# EAGLE design DCC sDecoder (EAGLE 9.6.2)
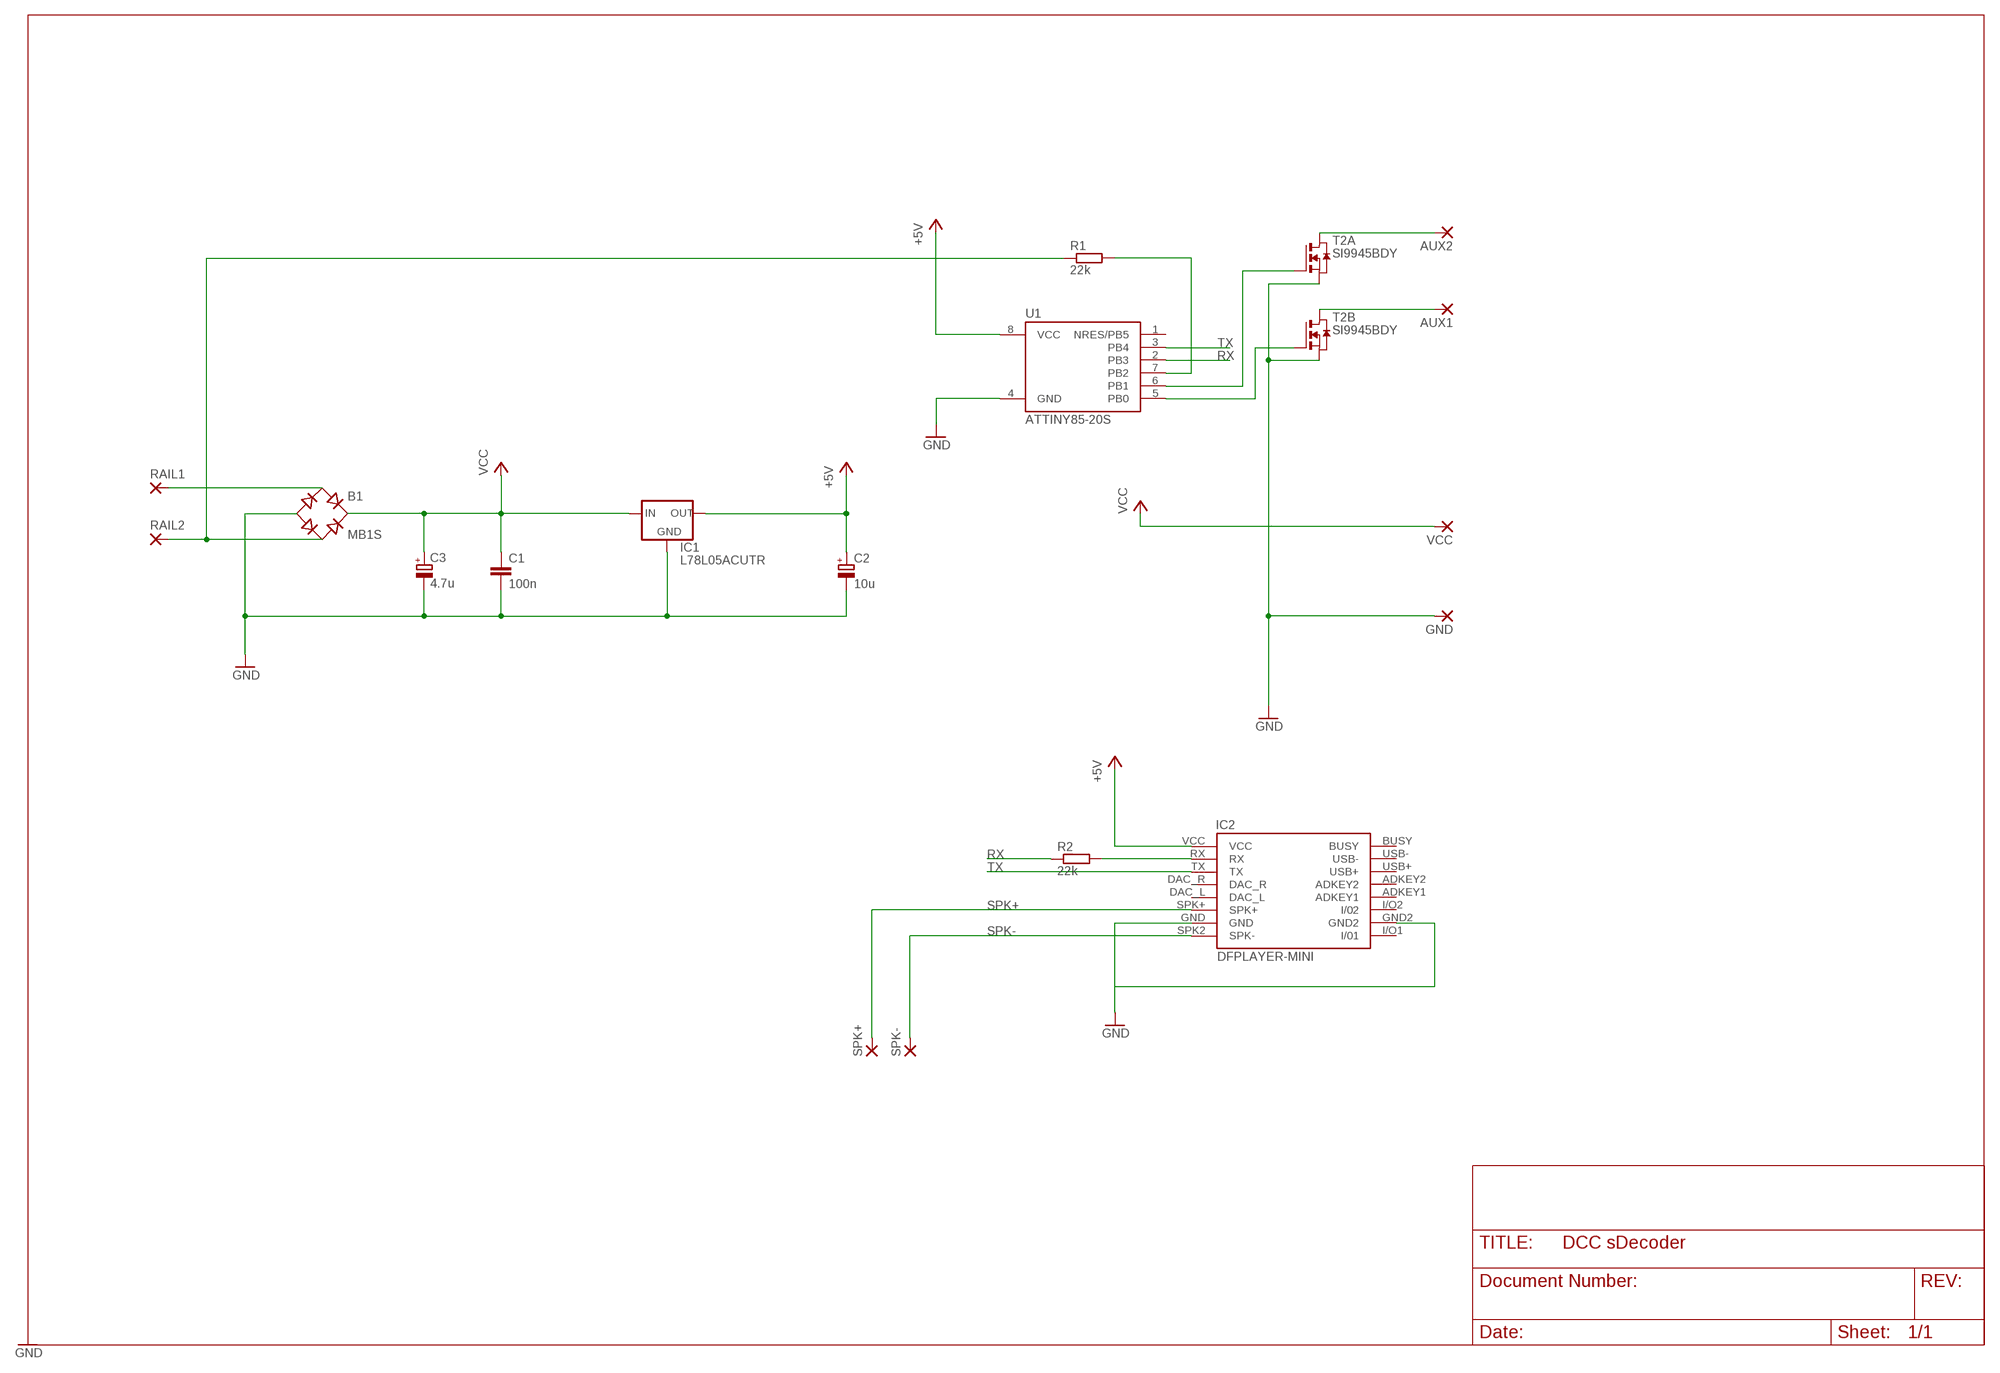
[diagram p0: schematic, sheet 1]

## Parts
AUX1  SMD2  [SMD1,27-2,54]
AUX2  SMD2  [SMD1,27-2,54]
B1  MB1S  [SOIC-4]
C1  100n  C-EUC0805  [C0805]
C2  10u  CPOL-EUA/3216-18W  [A/3216-18W]
C3  4.7u  CPOL-EUA/3216-18W  [A/3216-18W]
GND  SMD2  [SMD1,27-2,54]
IC1  L78L05ACUTR  [SOT89R]
IC2  DFPLAYER-MINI  [DFPLAYER-MINI]
R1  22k  R-EU_R0805  [R0805]
R2  22k  R-EU_R0805  [R0805]
RAIL1  SMD2  [SMD1,27-2,54]
RAIL2  SMD2  [SMD1,27-2,54]
SPK+  SMD2  [SMD1,27-2,54]
SPK-  SMD2  [SMD1,27-2,54]
T2  SI9945BDY  NMOS2SO8  [SO8]
U1  ATTINY85-20S  [SOIC8_EIAJ_208MIL]
VCC  SMD2  [SMD1,27-2,54]

## Nets
+5V: C2.+ IC1.2(OUT) IC2.VCC U1.8(VCC)
GND: B1.- C1.2 C2.- C3.- GND.1(P) IC1.3(GND) IC1.4(GND) IC2.GND IC2.GND2 T2.1(A:S) T2.3(B:S) U1.4(GND)
N$1: IC2.RX R2.2
N$2: AUX2.1(P) T2.7(A:D) T2.8(A:D)
N$3: AUX1.1(P) T2.5(B:D) T2.6(B:D)
N$5: T2.4(B:G) U1.5(PB0)
N$7: T2.2(A:G) U1.6(PB1)
N$10: B1.~2(AC2) R1.1 RAIL2.1(P)
N$11: R1.2 U1.7(PB2)
N$12: B1.~1(AC1) RAIL1.1(P)
RX: R2.1 U1.2(PB3)
SPK+: IC2.SPK+ SPK+.1(P)
SPK-: IC2.SPK2(SPK-) SPK-.1(P)
TX: IC2.TX U1.3(PB4)
VCC: B1.+ C1.1 C3.+ IC1.1(IN) VCC.1(P)
Unconnected: IC2.ADKEY1 IC2.ADKEY2 IC2.BUSY IC2.DAC_L IC2.DAC_R IC2.I/O1(I/01) IC2.I/O2(I/02) IC2.USB+ IC2.USB- U1.1(NRES/PB5)

## Library data of the parts
AUX1 AUX2 GND RAIL1 RAIL2 SPK+ SPK- VCC = wirepad:SMD2: SMD PAD
B1 = rectifier:MB*S: Bridge Rectifier Source: http://www.fairchildsemi.com/ds/MB/MB6S.pdf
C1 = rcl:C-EU: CAPACITOR, European symbol
C2 C3 = rcl:CPOL-EU: POLARIZED CAPACITOR, European symbol
IC1 = _smd:L78L05ACUTR
IC2 = _eigene:DFPLAYER-MINI
R1 R2 = rcl:R-EU_: RESISTOR, European symbol
T2 = zetex:NMOS2: Dual MOS FET; OC_FARNELL: unknown; OC_NEWARK: unknown
U1 = attiny25_45_85:ATTINY85*: ATMEL ATtiny 85 Packages: P = PDIP 08 30mil S = SOIC 08 EIAJ 208mil Technologies Note: for complete ordering code (temp. range, finish, tape&reel etc.) see www.atmel.com • Supply Voltage: V = (1.8…5.5)V | [blank] = (2.7…5.5)V • Speed: 10 = 10 MHz | 20 = 20 MHz Author: Dipl.-Ing. FH Rainer Bayer HHN Hochschule Heilbronn (Heilbronn University), rainer.bayer@hs-heilbronn.de Ingenieurbüro ing-rb, mail@ing-rb.de

## Board
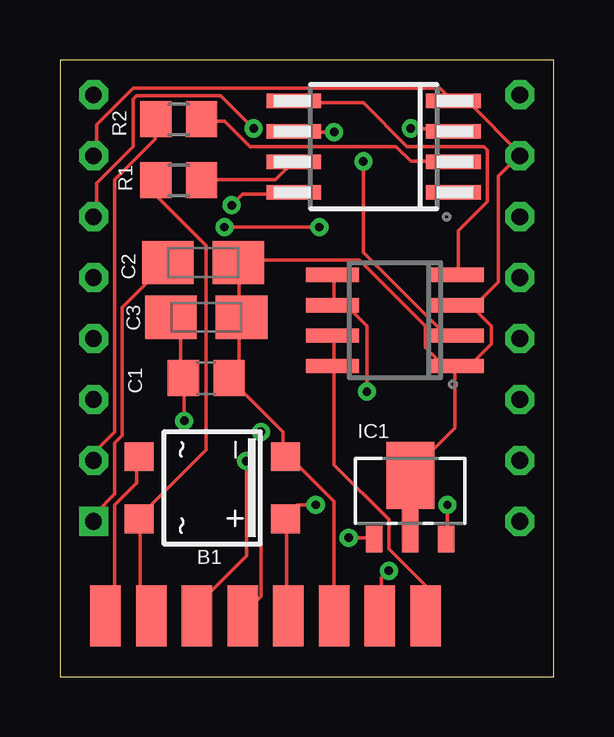
[diagram p1: board, top side]
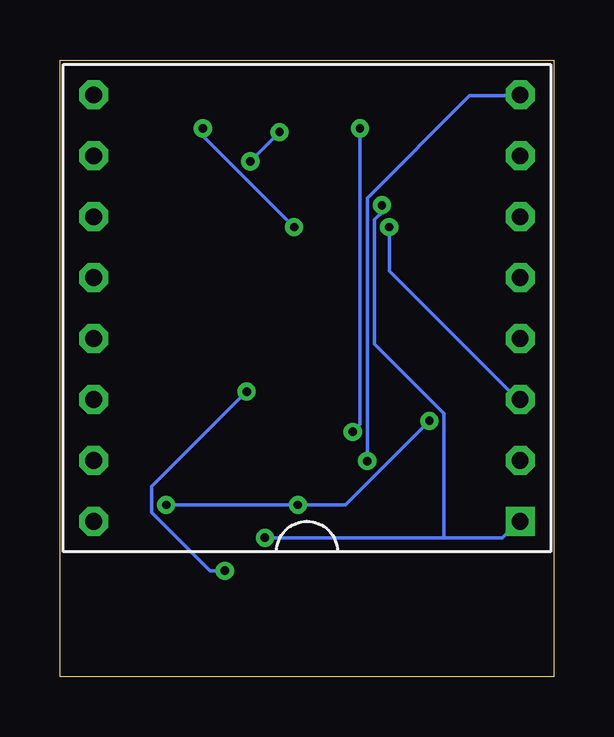
[diagram p2: board, bottom side, seen from below]

Size 20.59 x 25.71 mm. Coordinates in mm from the lower left corner, seen from the top.
Outline: 0,0 20.59,0 20.59,25.71 0,25.71 0,0
Copper layers (1*16): Top 0.035mm / dielectric 1.5mm / Bottom 0.035mm
Design rules "default": minimum track width 6mil, minimum drill 0.35mm, track to track 6mil, track to pad 6mil, pad to pad 6mil, via to via 6mil, smd to smd 6mil, copper to edge 40mil, drill to drill 6mil, minimum pad ring 10mil, minimum via ring 8mil, stop-mask expansion 4mil, vias tented up to drill 0mil, thermal gap 10mil

### Footprints (pad centres in the part's own frame; a part is rotated, then mirrored left to right if it is on the bottom)
SMD1,27-2,54 = smd 1.27 x 2.54: 1 0,0
SOIC-4 = smd 1.2 x 1.2: + 1.3,3.05; - -1.3,3.05; ~1 -1.3,-3.05; ~2 1.3,-3.05
C0805 = smd 1.3 x 1.5: 1 -0.95,0; 2 0.95,0
A/3216-18W = smd 2.15 x 1.8: + 1.475,0; - -1.475,0
SOT89R = smd 0.7 x 1.1: 1 1.5,-1.75; 2 -1.5,-1.75 | smd 0.7 x 1.8: 3 0,-1.4 | smd 2 x 2.8: 4 0,0.9
DFPLAYER-MINI = drill 0.7 octagon: ADKEY1 17.78,7.62; ADKEY2 17.78,10.16; BUSY 17.78,17.78; DAC_L 0,7.62; DAC_R 0,10.16; GND 0,2.54; GND2 17.78,2.54; I/O1 17.78,0; I/O2 17.78,5.08; RX 0,15.24; SPK2 0,0; SPK+ 0,5.08; TX 0,12.7; USB+ 17.78,12.7; USB- 17.78,15.24 | drill 0.7 square: VCC 0,17.78
R0805 = smd 1.3 x 1.5: 1 -0.95,0; 2 0.95,0
SO8 = smd 0.6 x 2.2: 1 -1.905,-2.6; 2 -0.635,-2.6; 3 0.635,-2.6; 4 1.905,-2.6; 5 1.905,2.6; 6 0.635,2.6; 7 -0.635,2.6; 8 -1.905,2.6
SOIC8_EIAJ_208MIL = smd 0.6 x 2.286: 1 -1.905,-3.33; 2 -0.635,-3.33; 3 0.635,-3.33; 4 1.905,-3.33; 5 1.905,3.33; 6 0.635,3.33; 7 -0.635,3.33; 8 -1.905,3.33

### Placement (x,y rotation side)
AUX1  13.34,2.54 180 top
AUX2  15.24,2.54 180 top
B1  6.35,7.87 270 top
C1  6.1,12.45 0 top
C2  5.97,17.27 180 top
C3  6.1,14.99 180 top
GND  11.43,2.54 0 top
IC1  14.61,7.49 0 top
IC2  1.4,24.26 180 bottom
R1  4.95,20.7 0 top
R2  4.95,23.24 180 top
RAIL1  1.91,2.54 180 top
RAIL2  3.81,2.54 180 top
SPK+  7.62,2.54 0 top
SPK-  5.71,2.54 0 top
T2  13.97,14.86 90 top
U1  13.08,22.1 90 top
VCC  9.53,2.54 180 top

### Tracks (layer width: path | path; a pad name or v marks a point on that pad's centre or on a via)
+5V  (via drill 0.35)
  Top 0.152: v12.04,5.79 12.95,5.79 IC1.2 | C2.+ 4.42,17.22 2.59,15.39 2.59,10.06 2.29,9.75 2.29,7.62 1.52,6.86 1.52,6.55 IC2.VCC | v7.16,19.66 7.62,20.12 9.6,20.12 U1.8
  Bottom 0.152: 4.57,5.79 2.13,5.79 1.52,6.4 IC2.VCC | 4.57,5.79 v12.04,5.79 | v7.16,19.66 7.16,19.36 7.47,19.05 7.47,13.87 4.57,10.97 4.57,5.79
GND
  Top 0.152: GND.1 11.43,7.32 9.45,9.3 B1.- 9.3,9.3 9.3,10.21 7.16,12.34 C1.2 7.16,12.5 7.47,12.8 7.47,14.94 C3.- 7.47,15.09 7.47,17.22 C2.- 7.47,17.37 12.5,17.37 15.24,14.63 15.24,13.72 16,12.95 16.46,12.95 | 17.22,15.39 17.98,14.63 17.98,13.87 17.07,12.95 T2.1 16.46,12.95 | 17.22,15.39 16.61,15.39 T2.3 17.22,15.39 | IC1.3 14.63,6.1 14.63,8.38 IC1.4 14.63,8.53 16.46,10.36 16.46,12.95 | IC2.GND 1.52,21.79 1.52,23.01 3.05,24.54 15.85,24.54 16.31,24.08 U1.4 16.46,23.93 17.07,23.93 19.2,21.79 IC2.GND2 19.05,21.64 18.29,20.88 18.29,16.46 17.22,15.39
N$1
  Top 0.152: R2.2 3.96,23.16 3.96,22.4 2.29,20.73 2.29,10.21 1.52,9.45 1.52,9.14 IC2.RX
N$2
  Top 0.152: 11.43,12.95 11.43,14.17 T2.7 | AUX2.1 15.24,3.81 13.72,5.33 13.72,6.55 11.43,8.84 11.43,12.95 | 11.43,12.95 T2.8
N$3  (via drill 0.35)
  Top 0.152: T2.5 11.43,16.76 11.43,15.54 T2.6 11.43,15.39 12.04,15.39 12.8,14.63 v12.8,11.89 | v13.72,4.42 13.41,4.12 13.41,2.59 AUX1.1
  Bottom 0.152: v13.72,4.42 14.33,4.42 16.76,6.86 16.76,7.92 v12.8,11.89
N$5
  Top 0.152: T2.4 16.61,16.76 16.61,18.59 17.83,19.81 17.83,21.95 17.68,22.1 14.48,22.1 12.65,23.93 9.75,23.93 U1.5
N$7  (via drill 0.35)
  Top 0.152: v12.65,21.49 12.65,17.68 16,14.33 16.46,14.33 T2.2 | v11.43,22.71 9.75,22.71 U1.6
  Bottom 0.152: v11.43,22.71 v12.65,21.49
N$10
  Top 0.152: RAIL2.1 3.81,2.59 3.35,3.05 3.35,6.55 B1.~2 3.35,6.71 6.1,9.45 6.1,17.98 4.12,19.96 4.12,20.57 R1.1
N$11
  Top 0.152: R1.2 5.94,20.73 8.99,20.73 9.6,21.34 U1.7
N$12
  Top 0.152: B1.~1 3.2,9.14 3.2,8.08 2.29,7.16 2.29,2.9 1.98,2.59 RAIL1.1
RX
  Top 0.152: R2.1 5.94,23.16 6.86,23.16 7.92,22.1 14.02,22.1 14.63,21.49 16.31,21.49 U1.2
SPK+  (via drill 0.35)
  Top 0.152: v8.08,22.86 6.71,24.23 3.2,24.23 3.05,24.08 3.05,22.1 1.52,20.57 1.52,19.2 IC2.SPK+ | v8.38,10.21 8.38,3.35 7.62,2.59 SPK+.1
  Bottom 0.152: v8.08,22.86 8.08,10.52 v8.38,10.21
SPK-  (via drill 0.35)
  Top 0.152: v7.77,8.99 7.77,5.03 5.79,3.05 5.79,2.59 SPK-.1
  Bottom 0.152: v7.77,8.99 7.77,19.96 3.5,24.23 1.52,24.23 IC2.SPK2
TX  (via drill 0.35)
  Top 0.152: v14.63,22.86 16.31,22.86 U1.3 | v6.86,18.75 v10.82,18.75
  Bottom 0.152: v14.63,22.86 14.63,22.55 v10.82,18.75 | v6.86,18.75 6.86,16.92 1.52,11.58 IC2.TX
VCC  (via drill 0.35)
  Top 0.152: C3.+ 4.72,14.94 5.03,14.63 5.03,12.5 C1.1 5.18,12.34 v5.18,10.67 | v16.15,7.16 16.15,5.79 IC1.1 | v10.67,7.16 9.91,7.16 9.45,6.71 B1.+ 9.45,6.55 9.45,2.59 VCC.1
  Bottom 0.152: v16.15,7.16 v10.67,7.16 8.69,7.16 v5.18,10.67

### Text on the board
tDocu: sDecoder 14.09.2020 AZ